# EAGLE schematic Brushless_motor_controller (EAGLE 9.6.2)
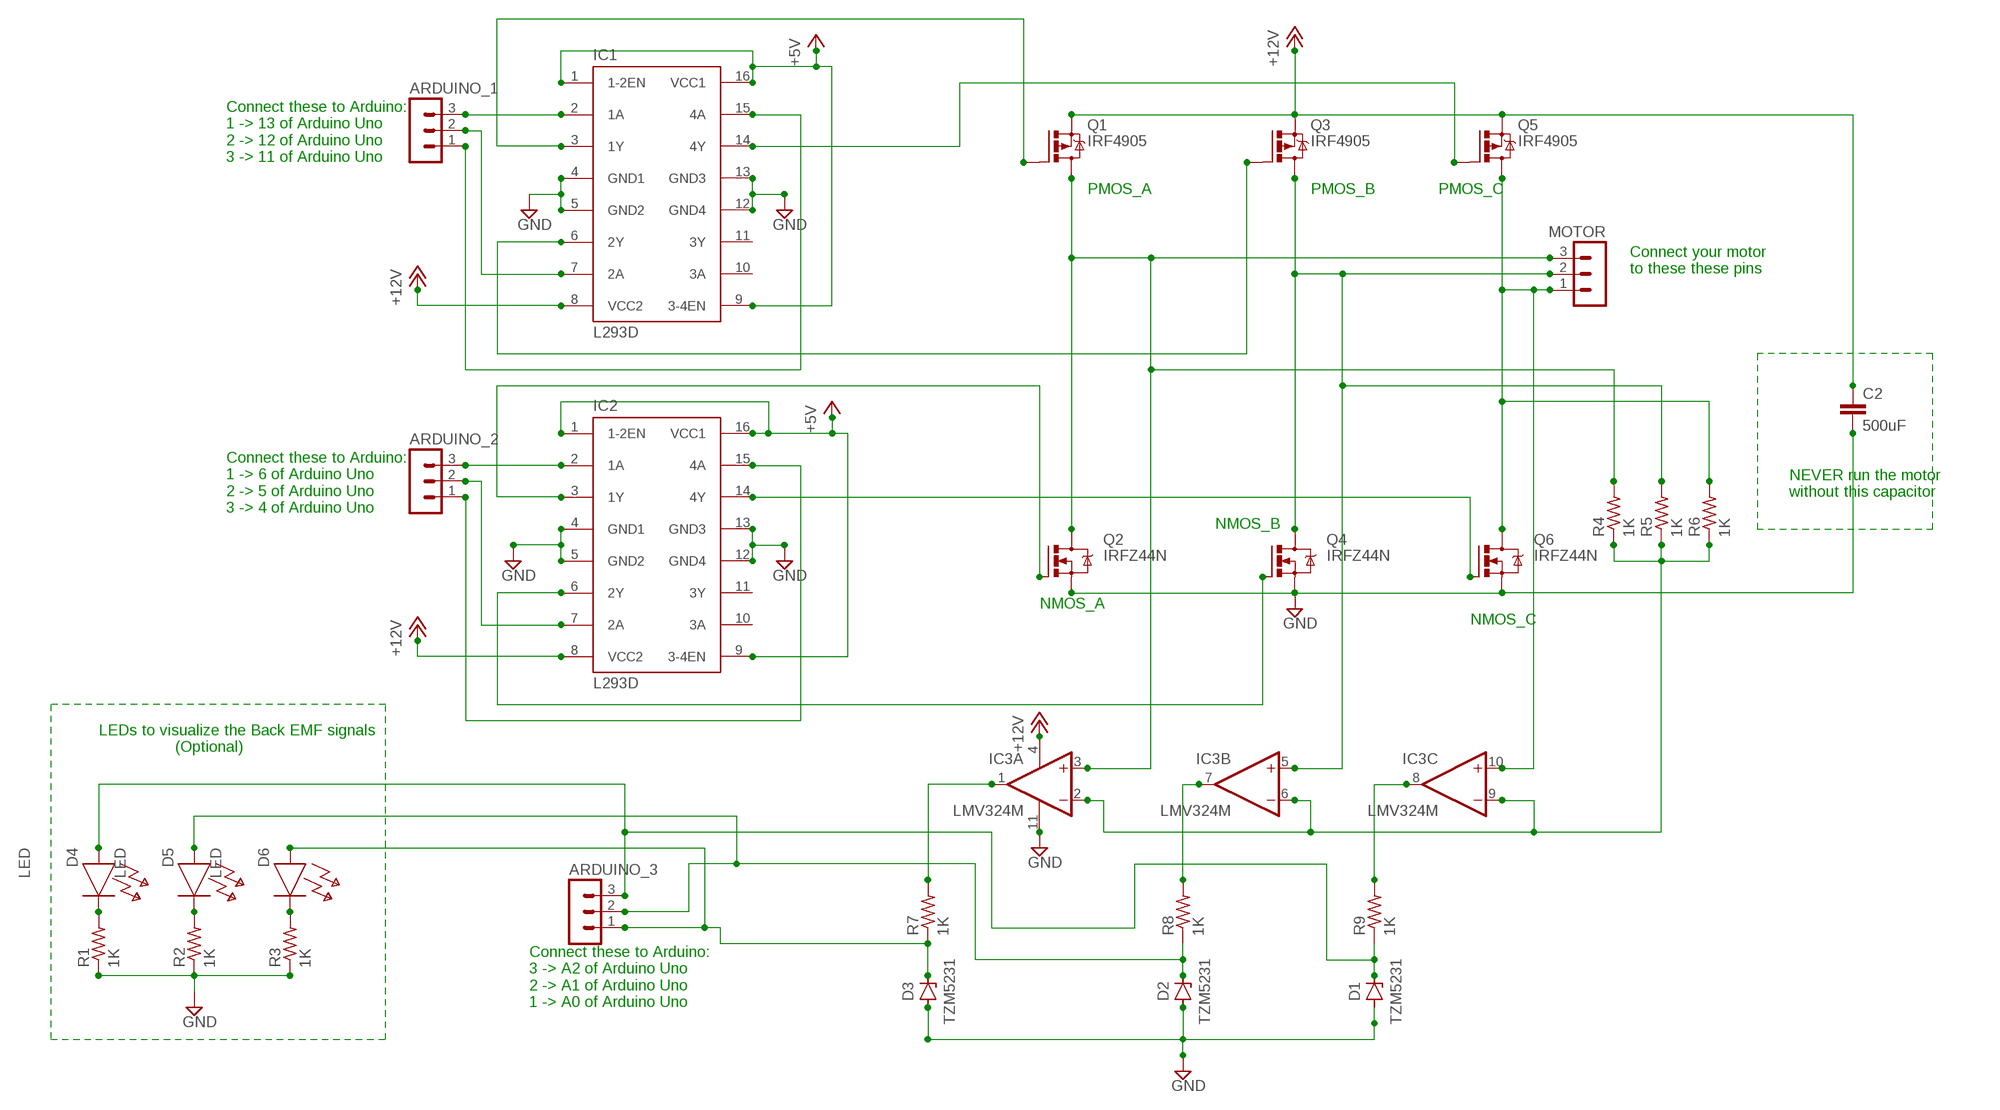
[diagram p0: schematic, sheet 1]

## Parts
ARDUINO_1  MA03-1  [MA03-1]
ARDUINO_2  MA03-1  [MA03-1]
ARDUINO_3  MA03-1  [MA03-1]
C2  500uF  C2,5-3  [C2.5-3]
D1  TZM5231  ZENER_TZM5231BDO-213AA(SOD-80)  [DIOMELF3516]
D2  TZM5231  ZENER_TZM5231BDO-213AA(SOD-80)  [DIOMELF3516]
D3  TZM5231  ZENER_TZM5231BDO-213AA(SOD-80)  [DIOMELF3516]
D4  LED  (no package)
D5  LED  (no package)
D6  LED  (no package)
IC1  L293D  [DIL16]
IC2  L293D  [DIL16]
IC3  LMV324M  [SO14]
MOTOR  MA03-1  [MA03-1]
Q1  IRF4905  [TO220BH]
Q2  IRFZ44N  IRLZ44Z  [TO220BH]
Q3  IRF4905  [TO220BH]
Q4  IRFZ44N  IRLZ44Z  [TO220BH]
Q5  IRF4905  [TO220BH]
Q6  IRFZ44N  IRLZ44Z  [TO220BH]
R1  1K  R-US_V235/17  [V235/17]
R2  1K  R-US_V235/17  [V235/17]
R3  1K  R-US_V235/17  [V235/17]
R4  1K  R-US_V235/17  [V235/17]
R5  1K  R-US_V235/17  [V235/17]
R6  1K  R-US_V235/17  [V235/17]
R7  1K  R-US_V235/17  [V235/17]
R8  1K  R-US_V235/17  [V235/17]
R9  1K  R-US_V235/17  [V235/17]

## Nets
+5V: IC1.1(1-2EN) IC1.9(3-4EN) IC1.16(VCC1) IC2.1(1-2EN) IC2.9(3-4EN) IC2.16(VCC1)
+12V: C2.1 IC1.8(VCC2) IC2.8(VCC2) IC3.4(P:V+) Q1.S Q3.S Q5.S
GND: C2.2 D1.2(A) D2.2(A) D3.2(A) IC1.4(GND1) IC1.5(GND2) IC1.12(GND4) IC1.13(GND3) IC2.4(GND1) IC2.5(GND2) IC2.12(GND4) IC2.13(GND3) IC3.11(P:V-) Q2.S Q4.S Q6.S R1.1 R2.1 R3.1
N$1: IC3.3(A:+IN) MOTOR.3 Q1.D Q2.D R4.2
N$2: IC3.5(B:+IN) MOTOR.2 Q3.D Q4.D R5.2
N$3: IC3.10(C:+IN) MOTOR.1 Q5.D Q6.D R6.2
N$4: IC1.3(1Y) Q1.G
N$5: IC1.14(4Y) Q5.G
N$6: IC1.6(2Y) Q3.G
N$7: IC2.3(1Y) Q2.G
N$8: IC2.14(4Y) Q6.G
N$9: IC2.6(2Y) Q4.G
N$10: D4.C R1.2
N$11: ARDUINO_2.3 IC2.2(1A)
N$12: D5.C R2.2
N$13: ARDUINO_2.2 IC2.7(2A)
N$14: ARDUINO_1.3 IC1.2(1A)
N$15: ARDUINO_1.2 IC1.7(2A)
N$16: ARDUINO_1.1 IC1.15(4A)
N$17: ARDUINO_2.1 IC2.15(4A)
N$18: IC3.2(A:-IN) IC3.6(B:-IN) IC3.9(C:-IN) R4.1 R5.1 R6.1
N$19: ARDUINO_3.1 D3.1(C) D6.A R7.1
N$20: ARDUINO_3.2 D2.1(C) D5.A R8.1
N$21: ARDUINO_3.3 D1.1(C) D4.A R9.1
N$22: IC3.8(C:OUT) R9.2
N$23: IC3.7(B:OUT) R8.2
N$24: IC3.1(A:OUT) R7.2
N$25: D6.C R3.2
Unconnected: IC1.10(3A) IC1.11(3Y) IC2.10(3A) IC2.11(3Y) IC3.12(D:+IN) IC3.13(D:-IN) IC3.14(D:OUT)

## Notes on the sheet
- Connect these to Arduino:
  1 -> 13 of Arduino Uno
  2 -> 12 of Arduino Uno
  3 -> 11 of Arduino Uno
- PMOS_A | PMOS_B | PMOS_C
- Connect your motor 
  to these these pins
- NEVER run the motor
  without this capacitor
- Connect these to Arduino:
  1 -> 6 of Arduino Uno
  2 -> 5 of Arduino Uno
  3 -> 4 of Arduino Uno
- NMOS_B
- NMOS_A
- NMOS_C
- LEDs to visualize the Back EMF signals
                   (Optional)
- Connect these to Arduino:
  3 -> A2 of Arduino Uno
  2 -> A1 of Arduino Uno
  1 -> A0 of Arduino Uno

## Library data of the parts
ARDUINO_1-ARDUINO_3 MOTOR = con-lstb:MA03-1: PIN HEADER; OC_FARNELL: unknown; OC_NEWARK: unknown
C2 = capacitor-wima:C: CAPACITOR naming: grid - package width
D1-D3 = Diode:ZENER_: Zener Diode - Popular parts; CATEGORY: Diode; DESCRIPTION: DIODE ZENER 5.1V 500MW SOD80; MANUFACTURER: Vishay Semiconductor Diodes Division; MPN: TZM5231B-GS08; SUB-CATEGORY: Zener; THERMALLOSS: 0.5W
D4-D6 = ngspice-simulation:LED: Diode
IC1 IC2 = st-microelectronics:L293D: PUSH-PULL 4 CHANNEL DRIVER; MPN: L293D; OC_FARNELL: 9589619; OC_NEWARK: 56P8249
IC3 = linear:LMV324?*: Quad General Purpose, Low Voltage, Rail-to-Rail Output Operational Amplifiers Source: http://www.national.com/mpf/LM/LMV321.html http://www.national.com/dt/lmv_qual.pdf
Q1 Q3 Q5 = transistor-power:IRF4905: P-Channel HEXFET® Power MOSFET RDS(on)= 0.02 Ohm, ID = -74A Source: http://www.irf.com/product-info/datasheets/data/irf4905pbf.pdf
Q2 Q4 Q6 = transistor-power:IRLZ44Z: N-Channel HEXFET® Power MOSFET Logic Level AUTOMOTIVE MOSFET Source: http://www.irf.com/product-info/datasheets/data/irlz44zpbf.pdf
R1-R9 = rcl:R-US_: RESISTOR, American symbol; SPICEPREFIX: R